# Altium schematic sheet Whitespace_Daughtercard_xceiver.SchDoc: RF Transceiver Top Level Design & Signals
size A2; Author: Ryan E. Guerra; Revision: 1.0; SheetNumber: 4; SheetTotal: 10
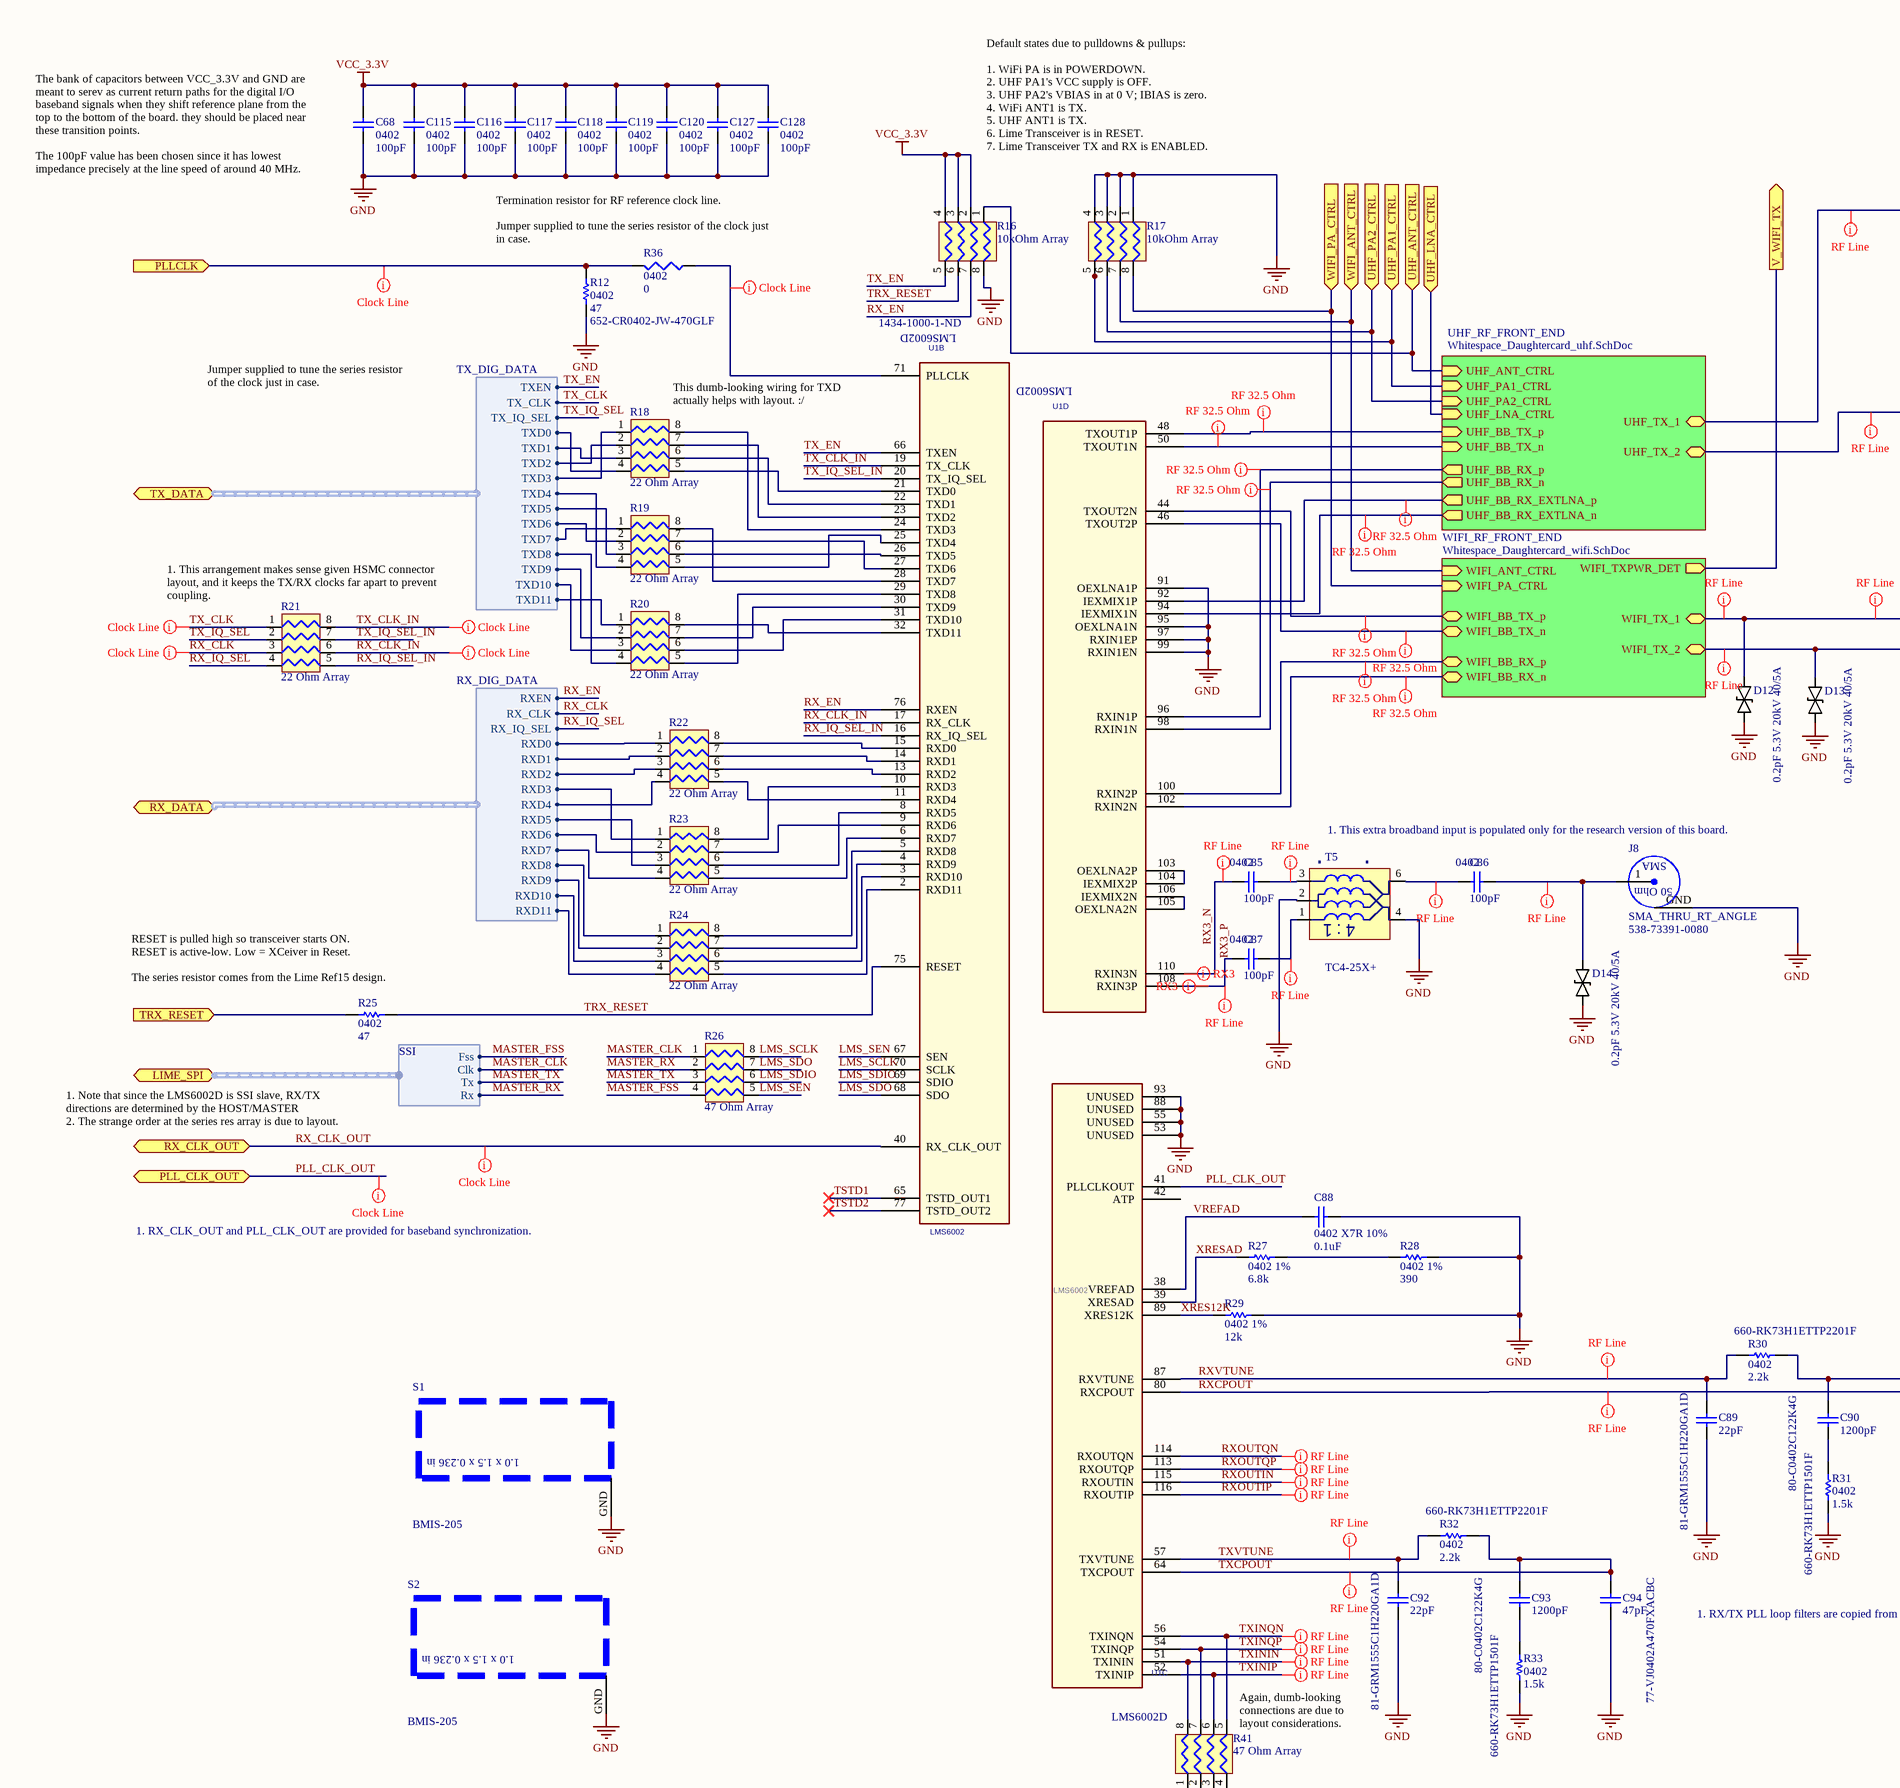
[diagram p0: Whitespace_Daughtercard_xceiver.SchDoc, top left]
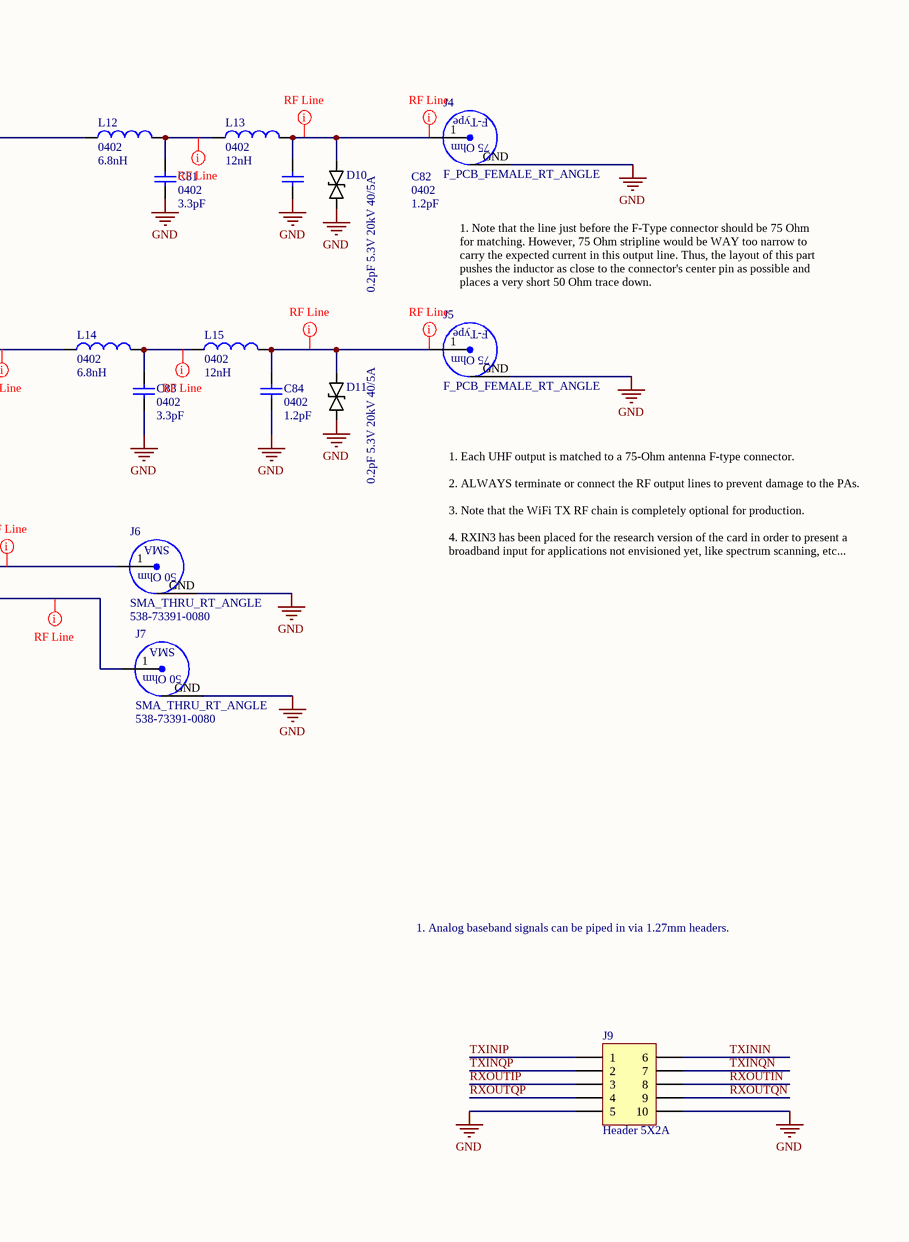
[diagram p1: Whitespace_Daughtercard_xceiver.SchDoc, top right]
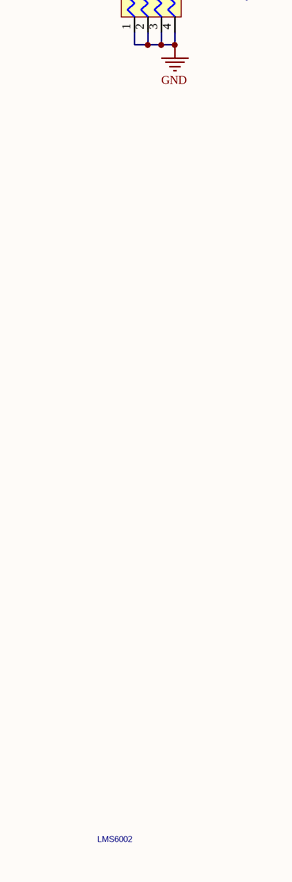
[diagram p2: Whitespace_Daughtercard_xceiver.SchDoc, bottom left]
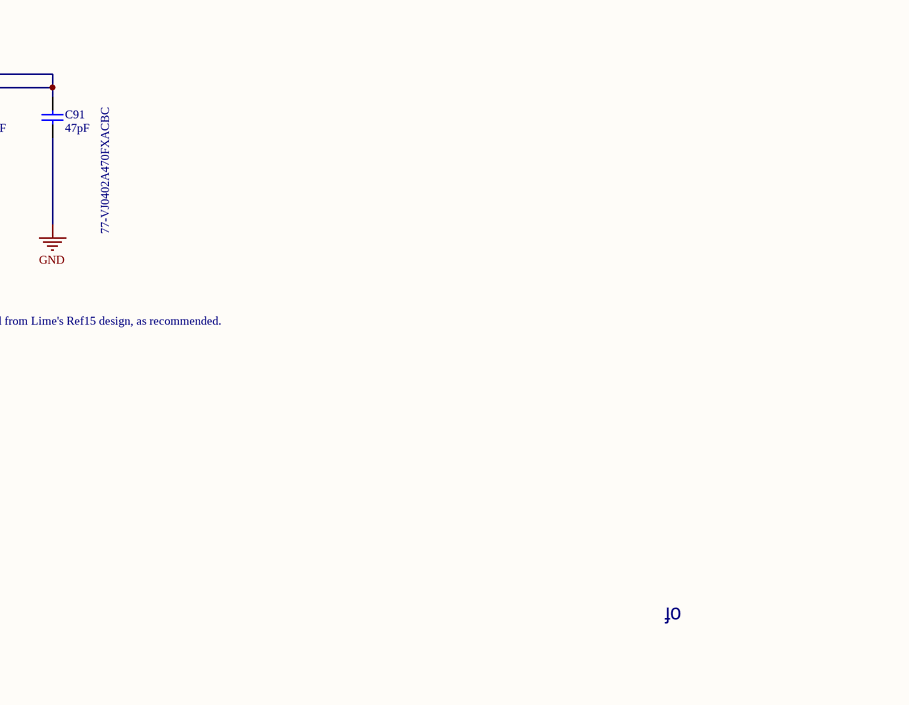
[diagram p3: Whitespace_Daughtercard_xceiver.SchDoc, bottom right]

## Parts
C68  0402  value 100pF  [0402_SMT_v3]
C81  0402  value 3.3pF  [0402_SMT_v3]
C82  0402  value 1.2pF  [0402_SMT_v3]
C83  0402  value 3.3pF  [0402_SMT_v3]
C84  0402  value 1.2pF  [0402_SMT_v3]
C85  0402  value 100pF  [0402_SMT_V3]
C86  0402  value 100pF  [0402_SMT_V3]
C87  0402  value 100pF  [0402_SMT_V3]
C88  0402 X7R 10%  value 0.1uF  [0402_SMT_V3]
C89  value 22pF  Supplier Part Number 1: 81-GRM1555C1H220GA1D  [0402_SMT_v3]  (hidden comment: 0402)
C90  value 1200pF  Supplier Part Number 1: 80-C0402C122K4G  [0402_SMT_v3]  (hidden comment: 0402)
C91  value 47pF  Supplier Part Number 1: 77-VJ0402A470FXACBC  [0402_SMT_v3]  (hidden comment: 0402)
C92  value 22pF  Supplier Part Number 1: 81-GRM1555C1H220GA1D  [0402_SMT_v3]  (hidden comment: 0402)
C93  value 1200pF  Supplier Part Number 1: 80-C0402C122K4G  [0402_SMT_v3]  (hidden comment: 0402)
C94  value 47pF  Supplier Part Number 1: 77-VJ0402A470FXACBC  [0402_SMT_v3]  (hidden comment: 0402)
C115  0402  value 100pF  [0402_SMT_v3]
C116  0402  value 100pF  [0402_SMT_v3]
C117  0402  value 100pF  [0402_SMT_v3]
C118  0402  value 100pF  [0402_SMT_v3]
C119  0402  value 100pF  [0402_SMT_v3]
C120  0402  value 100pF  [0402_SMT_v3]
C127  0402  value 100pF  [0402_SMT_v3]
C128  0402  value 100pF  [0402_SMT_v3]
D10  0.2pF 5.3V 20kV 40/5A  [TSLP-2-17]
D11  0.2pF 5.3V 20kV 40/5A  [TSLP-2-17]
D12  0.2pF 5.3V 20kV 40/5A  [TSLP-2-17]
D13  0.2pF 5.3V 20kV 40/5A  [TSLP-2-17]
D14  0.2pF 5.3V 20kV 40/5A  [TSLP-2-17]
J4  F_PCB_FEMALE_RT_ANGLE  [F_RT_ANGLE_PCB_FEMALE_5-1634540-1]
J5  F_PCB_FEMALE_RT_ANGLE  [F_RT_ANGLE_PCB_FEMALE_5-1634540-1]
J6  SMA_THRU_RT_ANGLE  Supplier Part Number 1: 538-73391-0080  [SMA_PCB_RtAngle_Female_MolexSD-73391-008_v4]
J7  SMA_THRU_RT_ANGLE  Supplier Part Number 1: 538-73391-0080  [SMA_PCB_RtAngle_Female_MolexSD-73391-008_v4]
J8  SMA_THRU_RT_ANGLE  Supplier Part Number 1: 538-73391-0080  [SMA_PCB_RtAngle_Female_MolexSD-73391-008_v4]
J9  Header 5X2A  [HDR2X5_CEN]
L12  0402  value 6.8nH  [0402_SMT_v3]
L13  0402  value 12nH  [0402_SMT_v3]
L14  0402  value 6.8nH  [0402_SMT_v3]
L15  0402  value 12nH  [0402_SMT_v3]
R12  0402  value 47  Supplier Part Number 1: 652-CR0402-JW-470GLF  [0402_SMT_v3]
R16  10kOhm Array  [741X083_ChipArray_0402x4_v2]
R17  10kOhm Array  [741X083_ChipArray_0402x4_v2]
R18  22 Ohm Array  [741X083_ChipArray_0402x4_v2]
R19  22 Ohm Array  [741X083_ChipArray_0402x4_v2]
R20  22 Ohm Array  [741X083_ChipArray_0402x4_v2]
R21  22 Ohm Array  [741X083_ChipArray_0402x4_v2]
R22  22 Ohm Array  [741X083_ChipArray_0402x4_v2]
R23  22 Ohm Array  [741X083_ChipArray_0402x4_v2]
R24  22 Ohm Array  [741X083_ChipArray_0402x4_v2]
R25  0402  value 47  [0402_SMT_v3]
R26  47 Ohm Array  [741X083_ChipArray_0402x4_v2]
R27  0402 1%  value 6.8k  [0402_SMT_v3]
R28  0402 1%  value 390  [0402_SMT_v3]
R29  0402 1%  value 12k  [0402_SMT_v3]
R30  0402  value 2.2k  Supplier Part Number 1: 660-RK73H1ETTP2201F  [0402_SMT_v3]
R31  0402  value 1.5k  Supplier Part Number 1: 660-RK73H1ETTP1501F  [0402_SMT_v3]
R32  0402  value 2.2k  Supplier Part Number 1: 660-RK73H1ETTP2201F  [0402_SMT_v3]
R33  0402  value 1.5k  Supplier Part Number 1: 660-RK73H1ETTP1501F  [0402_SMT_v3]
R36  0402  value 0  [0402_SMT_v3]
R41  47 Ohm Array  [741X083_ChipArray_0402x4_v2]
S1  BMIS-205  [BMIS-205]
S2  BMIS-205  [BMIS-205]
T5  TC4-25X+  [AT224-1_V2]
U1  LMS6002  Supplier Part Number 1: 1434-1000-1-ND  [LMS6002D_VIAOFFPAD_v2_Window]  (parts B,C,D of 4)

## Sub-sheets
UHF_RF_FRONT_END = Whitespace_Daughtercard_uhf.SchDoc: UHF_PA2_CTRL (in), UHF_TX_1 (bidir), UHF_TX_2 (bidir), UHF_ANT_CTRL (in), UHF_PA1_CTRL (in), UHF_BB_TX_p (in), UHF_BB_TX_n (in), UHF_BB_RX_p (out), UHF_BB_RX_n (out), UHF_BB_RX_EXTLNA_p (out), UHF_BB_RX_EXTLNA_n (out), UHF_LNA_CTRL (in)
WIFI_RF_FRONT_END = Whitespace_Daughtercard_wifi.SchDoc: WIFI_TXPWR_DET (out), WIFI_TX_2, WIFI_TX_1, WIFI_BB_TX_p, WIFI_BB_RX_p, WIFI_BB_RX_n, WIFI_BB_TX_n, WIFI_ANT_CTRL (in), WIFI_PA_CTRL (in)

## Ports
LIME_SPI (harness SSI), PLL_CLK_OUT, PLLCLK (in), RX_CLK_OUT, RX_DATA (harness RX_DIG_DATA), TRX_RESET (in), TX_DATA (harness TX_DIG_DATA), UHF_ANT_CTRL (in), UHF_LNA_CTRL (in), UHF_PA1_CTRL (in), UHF_PA2_CTRL (in), V_WIFI_TX (out), WIFI_ANT_CTRL (in), WIFI_PA_CTRL (in)

## Harnesses
TX_DIG_DATA: TXEN, TX_CLK, TX_IQ_SEL, TXD0, TXD1, TXD2, TXD3, TXD4, TXD5, TXD6, TXD7, TXD8, TXD9, TXD10, TXD11
RX_DIG_DATA: RXEN, RX_CLK, RX_IQ_SEL, RXD0, RXD2, RXD3, RXD4, RXD5, RXD6, RXD7, RXD8, RXD9, RXD10, RXD11, RXD1
SSI: Fss, Clk, Tx, Rx

## Nets
GND: C68.2 C81.1 C82.1 C83.1 C84.1 C88.1 C89.1 C91.1 C92.1 C94.1 C115.2 C116.2 C117.2 C118.2 C119.2 C120.2 C127.2 C128.2 D10.1 D11.1 D12.1 D13.1 D14.1 J4.GND J5.GND J6.GND J7.GND J8.GND J9.5 J9.10 R12.1 R16.8 R17.1 R17.2 R17.3 R17.4 R28.1 R29.2 R31.1 R33.1 R41.1 R41.2 R41.3 R41.4 S1.GND S2.GND T5.2(S_CT) T5.4(P) U1.53(UNUSED) U1.55(UNUSED) U1.88(UNUSED) U1.91(OEXLNA1P) U1.93(UNUSED) U1.95(OEXLNA1N) U1.97(RXIN1EP) U1.99(RXIN1EN)
VCC_3.3V: C68.1 C115.1 C116.1 C117.1 C118.1 C119.1 C120.1 C127.1 C128.1 R16.2 R16.3 R16.4
LMS_SCLK: R26.8 U1.70(SCLK)
LMS_SDIO: R26.6 U1.69(SDIO)
LMS_SDO: R26.7 U1.68(SDO)
LMS_SEN: R26.5 U1.67(SEN)
MASTER_CLK: R26.1 ; port LIME_SPI.Clk
MASTER_FSS: R26.4 ; port LIME_SPI.Fss
MASTER_RX: R26.2 ; port LIME_SPI.Rx
MASTER_TX: R26.3 ; port LIME_SPI.Tx
PLL_CLK_OUT: U1.41(PLLCLKOUT) ; port PLL_CLK_OUT
PLLCLK: R12.2 R36.2 ; port PLLCLK
RX3_N: C85.2 U1.110(RXIN3N)
RX3_P: C87.2 U1.108(RXIN3P)
RX_CLK: R21.3 ; port RX_DATA.RX_CLK
RX_CLK_IN: R21.6 U1.17(RX_CLK)
RX_CLK_OUT: U1.40(RX_CLK_OUT) ; port RX_CLK_OUT
RX_EN: R16.7 U1.76(RXEN) ; port RX_DATA.RXEN
RX_IQ_SEL: R21.4 ; port RX_DATA.RX_IQ_SEL
RX_IQ_SEL_IN: R21.5 U1.16(RX_IQ_SEL)
RXCPOUT: C90.2 C91.2 R30.2 U1.80(RXCPOUT)
RXOUTIN: J9.8 U1.115(RXOUTIN)
RXOUTIP: J9.3 U1.116(RXOUTIP)
RXOUTQN: J9.9 U1.114(RXOUTQN)
RXOUTQP: J9.4 U1.113(RXOUTQP)
RXVTUNE: C89.2 R30.1 U1.87(RXVTUNE)
TRX_RESET: R16.6 R25.1 U1.75(RESET)
TRX_RESET: R25.2 ; port TRX_RESET  [a separate net that carries the same name]
TSTD1: U1.65(TSTD_OUT1)
TSTD2: U1.77(TSTD_OUT2)
TX_CLK: R21.1 ; port TX_DATA.TX_CLK
TX_CLK_IN: R21.8 U1.19(TX_CLK)
TX_EN: R16.5 U1.66(TXEN) ; port TX_DATA.TXEN
TX_IQ_SEL: R21.2 ; port TX_DATA.TX_IQ_SEL
TX_IQ_SEL_IN: R21.7 U1.20(TX_IQ_SEL)
TXCPOUT: C93.2 C94.2 R32.2 U1.64(TXCPOUT)
TXININ: J9.6 R41.8 U1.51(TXININ)
TXINIP: J9.1 R41.6 U1.52(TXINIP)
TXINQN: J9.7 R41.5 U1.56(TXINQN)
TXINQP: J9.2 R41.7 U1.54(TXINQP)
TXVTUNE: C92.2 R32.1 U1.57(TXVTUNE)
UHF_ANT_CTRL: R16.1 ; port UHF_ANT_CTRL, sheet UHF_RF_FRONT_END/UHF_ANT_CTRL
UHF_LNA_CTRL: port UHF_LNA_CTRL, sheet UHF_RF_FRONT_END/UHF_LNA_CTRL
UHF_PA1_CTRL: R17.5 ; port UHF_PA1_CTRL, sheet UHF_RF_FRONT_END/UHF_PA1_CTRL
UHF_PA2_CTRL: R17.6 ; port UHF_PA2_CTRL, sheet UHF_RF_FRONT_END/UHF_PA2_CTRL
V_WIFI_TX: port V_WIFI_TX, sheet WIFI_RF_FRONT_END/WIFI_TXPWR_DET
VREFAD: C88.2 U1.38(VREFAD)
WIFI_ANT_CTRL: R17.7 ; port WIFI_ANT_CTRL, sheet WIFI_RF_FRONT_END/WIFI_ANT_CTRL
WIFI_PA_CTRL: R17.8 ; port WIFI_PA_CTRL, sheet WIFI_RF_FRONT_END/WIFI_PA_CTRL
XRES12K: R29.1 U1.89(XRES12K)
XRESAD: R27.2 U1.39(XRESAD)
NetC81_2: C81.2 L12.2 L13.1
NetC82_2: C82.2 D10.2 J4.1(Signal) L13.2
NetC83_2: C83.2 L14.2 L15.1
NetC84_2: C84.2 D11.2 J5.1(Signal) L15.2
NetC85_1: C85.1 T5.3(S_DOT)
NetC86_1: C86.1 D14.2 J8.1(Signal)
NetC86_2: C86.2 T5.6(P_DOT)
NetC87_1: C87.1 T5.1(S)
NetC90_1: C90.1 R31.2
NetC93_1: C93.1 R33.2
NetD12_2: D12.2 J6.1(Signal) ; sheet WIFI_RF_FRONT_END/WIFI_TX_1
NetD13_2: D13.2 J7.1(Signal) ; sheet WIFI_RF_FRONT_END/WIFI_TX_2
NetL12_1: L12.1 ; sheet UHF_RF_FRONT_END/UHF_TX_1
NetL14_1: L14.1 ; sheet UHF_RF_FRONT_END/UHF_TX_2
NetR18_1: R18.1 ; port TX_DATA.TXD3
NetR18_2: R18.2 ; port TX_DATA.TXD2
NetR18_3: R18.3 ; port TX_DATA.TXD1
NetR18_4: R18.4 ; port TX_DATA.TXD0
NetR18_5: R18.5 U1.21(TXD0)
NetR18_6: R18.6 U1.22(TXD1)
NetR18_7: R18.7 U1.23(TXD2)
NetR18_8: R18.8 U1.24(TXD3)
NetR19_1: R19.1 ; port TX_DATA.TXD7
NetR19_2: R19.2 ; port TX_DATA.TXD6
NetR19_3: R19.3 ; port TX_DATA.TXD5
NetR19_4: R19.4 ; port TX_DATA.TXD4
NetR19_5: R19.5 U1.25(TXD4)
NetR19_6: R19.6 U1.26(TXD5)
NetR19_7: R19.7 U1.27(TXD6)
NetR19_8: R19.8 U1.28(TXD7)
NetR20_1: R20.1 ; port TX_DATA.TXD11
NetR20_2: R20.2 ; port TX_DATA.TXD9
NetR20_3: R20.3 ; port TX_DATA.TXD10
NetR20_4: R20.4 ; port TX_DATA.TXD8
NetR20_5: R20.5 U1.29(TXD8)
NetR20_6: R20.6 U1.31(TXD10)
NetR20_7: R20.7 U1.30(TXD9)
NetR20_8: R20.8 U1.32(TXD11)
NetR22_1: R22.1 ; port RX_DATA.RXD0
NetR22_2: R22.2 ; port RX_DATA.RXD1
NetR22_3: R22.3 ; port RX_DATA.RXD2
NetR22_4: R22.4 ; port RX_DATA.RXD4
NetR22_5: R22.5 U1.11(RXD4)
NetR22_6: R22.6 U1.13(RXD2)
NetR22_7: R22.7 U1.14(RXD1)
NetR22_8: R22.8 U1.15(RXD0)
NetR23_1: R23.1 ; port RX_DATA.RXD3
NetR23_2: R23.2 ; port RX_DATA.RXD6
NetR23_3: R23.3 ; port RX_DATA.RXD5
NetR23_4: R23.4 ; port RX_DATA.RXD7
NetR23_5: R23.5 U1.6(RXD7)
NetR23_6: R23.6 U1.8(RXD5)
NetR23_7: R23.7 U1.9(RXD6)
NetR23_8: R23.8 U1.10(RXD3)
NetR24_1: R24.1 ; port RX_DATA.RXD8
NetR24_2: R24.2 ; port RX_DATA.RXD9
NetR24_3: R24.3 ; port RX_DATA.RXD10
NetR24_4: R24.4 ; port RX_DATA.RXD11
NetR24_5: R24.5 U1.2(RXD11)
NetR24_6: R24.6 U1.3(RXD10)
NetR24_7: R24.7 U1.4(RXD9)
NetR24_8: R24.8 U1.5(RXD8)
NetR27_1: R27.1 R28.2
NetR36_1: R36.1 U1.71(PLLCLK)
NetU1_44: U1.44(TXOUT2N) ; sheet WIFI_RF_FRONT_END/WIFI_BB_TX_p
NetU1_46: U1.46(TXOUT2P) ; sheet WIFI_RF_FRONT_END/WIFI_BB_TX_n
NetU1_48: U1.48(TXOUT1P) ; sheet UHF_RF_FRONT_END/UHF_BB_TX_p
NetU1_50: U1.50(TXOUT1N) ; sheet UHF_RF_FRONT_END/UHF_BB_TX_n
NetU1_92: U1.92(IEXMIX1P) ; sheet UHF_RF_FRONT_END/UHF_BB_RX_EXTLNA_p
NetU1_94: U1.94(IEXMIX1N) ; sheet UHF_RF_FRONT_END/UHF_BB_RX_EXTLNA_n
NetU1_96: U1.96(RXIN1P) ; sheet UHF_RF_FRONT_END/UHF_BB_RX_p
NetU1_98: U1.98(RXIN1N) ; sheet UHF_RF_FRONT_END/UHF_BB_RX_n
NetU1_100: U1.100(RXIN2P) ; sheet WIFI_RF_FRONT_END/WIFI_BB_RX_p
NetU1_102: U1.102(RXIN2N) ; sheet WIFI_RF_FRONT_END/WIFI_BB_RX_n
NetU1_103: U1.103(OEXLNA2P) U1.104(IEXMIX2P)
NetU1_105: U1.105(OEXLNA2N) U1.106(IEXMIX2N)

Not connected (* = marked no-connect by the designer): U1 42(ATP)

## Layout directives
rule Impedance Constraint [Min = 49.00    Max = 51.00    ]; net class RF: NetC81_2, NetC82_2, NetC83_2, NetC84_2, NetC85_1, NetC86_1, NetC86_2, NetC87_1, NetD12_2, NetD13_2, NetL12_1, NetL14_1, RX3_N, RX3_P, RXCPOUT, RXOUTIN, RXOUTIP, RXOUTQN, RXOUTQP, RXVTUNE, TXCPOUT, TXININ, TXINIP, TXINQN, TXINQP, TXVTUNE
rule Impedance Constraint [Min = 32.00    Max = 33.00    ]; net class RF_325: NetU1_44, NetU1_46, NetU1_48, NetU1_50, NetU1_92, NetU1_94, NetU1_96, NetU1_98, NetU1_100, NetU1_102
rule Impedance Constraint [Min = 49.00    Max = 51.00    ]; net class CLK: NetR36_1, PLL_CLK_OUT, PLLCLK, RX_CLK, RX_CLK_IN, RX_CLK_OUT, TX_CLK, TX_CLK_IN
differential pair: RX3_N, RX3_P

## Notes on the sheet
- (near C68) The bank of capacitors between VCC_3.3V and GND are meant to serev as current return paths for the digital I/O baseband signals when they shift reference plane from the top to the bottom of the board. they should be placed near these transition points.
  The 100pF value has been chosen since it has lowest impedance precisely at the line speed of around 40 MHz.
- Default states due to pulldowns & pullups:
  1. WiFi PA is in POWERDOWN.
  2. UHF PA1's VCC supply is OFF.
  3. UHF PA2's VBIAS in at 0 V; IBIAS is zero.
  4. WiFi ANT1 is TX.
  5. UHF ANT1 is TX.
  6. Lime Transceiver is in RESET.
  7. Lime Transceiver TX and RX is ENABLED.
- Termination resistor for RF reference clock line.
  Jumper supplied to tune the series resistor of the clock just in case.
- 1. Note that the line just before the F-Type connector should be 75 Ohm for matching. However, 75 Ohm stripline would be WAY too narrow to carry the expected current in this output line. Thus, the layout of this part pushes the inductor as close to the connector's center pin as possible and places a very short 50 Ohm trace down.
- Jumper supplied to tune the series resistor of the clock just in case.
- (near R18) This dumb-looking wiring for TXD actually helps with layout. :/
- (near R21) 1. This arrangement makes sense given HSMC connector layout, and it keeps the TX/RX clocks far apart to prevent coupling.
- 1. Each UHF output is matched to a 75-Ohm antenna F-type connector.
  2. ALWAYS terminate or connect the RF output lines to prevent damage to the PAs.
  3. Note that the WiFi TX RF chain is completely optional for production.
  4. RXIN3 has been placed for the research version of the card in order to present a broadband input for applications not envisioned yet, like spectrum scanning, etc...
- 1. This extra broadband input is populated only for the research version of this board.
- 1. Analog baseband signals can be piped in via 1.27mm headers.
- (near R25) RESET is pulled high so transceiver starts ON.
  RESET is active-low. Low = XCeiver in Reset.
  The series resistor comes from the Lime Ref15 design.
- 1. Note that since the LMS6002D is SSI slave, RX/TX directions are determined by the HOST/MASTER
  2. The strange order at the series res array is due to layout.
- 1. RX_CLK_OUT and PLL_CLK_OUT are provided for baseband synchronization.
- 1. RX/TX PLL loop filters are copied from Lime's Ref15 design, as recommended.
- (near R41) Again, dumb-looking connections are due to layout considerations.
- of
- (in symbol BMIS-205) 1.0 x 1.5 x 0.236 in
- (in symbol F_PCB_FEMALE_RT_ANGLE) F-Type; 75 Ohm
- (in symbol LMS6002, part B) LMS6002D
- (in symbol LMS6002, part C) LMS6002D
- (in symbol LMS6002, part D) LMS6002D
- (in symbol SMA_PCB_RT_ANGLE) SMA; 50 Ohm
- (in symbol TC4-25X+) .; 4 : 1

## Library data of the parts
C68 C81-C84 C115-C120 C127 C128 = Cap Semi: Capacitor (Semiconductor SIM Model); Published: 8-Jun-2000; LatestRevisionDate: 29-May-2009; LatestRevisionNote: IPC-7351 Footprint Added.; PackageReference: C1206; Publisher: Altium Limited; PackageDescription: Chip Capacitor; Supplier 1: Mouser
  C68 C115-C120 C127 C128: Supplier Part Number 1: 81-GRM1555C1H101GA1D
  C81 C83: Supplier Part Number 1: 81-GRM1555C1H3R3WA1D
  C82 C84: Supplier Part Number 1: 81-GRM1555C1H1R2WA1D
C85-C88 = Cap: Capacitor; Published: 8-Jun-2000; LatestRevisionDate: 17-Jul-2002; LatestRevisionNote: Re-released for DXP Platform.; PackageReference: RAD-0.3; Publisher: Altium Limited; PackageDescription: Radial Cap, Thru-Hole; 2 Leads; 0.3 in Pin Spacing; Supplier 1: Mouser
  C85-C87: Supplier Part Number 1: 81-GRM1555C1H101GA1D
  C88: Supplier Part Number 1: 810-C1005X7R1H104K
C89-C94 = Cap_0402: 0402 SMT Cap; Supplier 1: Mouser
D10-D14 = ESD0P2RF-02LRH: Bidirectional TVS Diode for RF Protection - Infineon; Supplier 1: Mouser; Supplier Part Number 1: 726-ESD0P2RF02LRH726
J4 J5 = F_PCB_FEMALE_RT_ANGLE: Right-Angle Through-PCB Female F-Type Connector, TE Connectivity, 75 Ohm; Supplier 1: Mouser; Supplier Part Number 1: 571-5-1634540-1
J6-J8 = SMA_PCB_RT_ANGLE: SMA 50 Ohm Female-NP Through Mount, Right-Angle Connector; Supplier 1: Mouser
J9 = Header 5X2A: Header, 5-Pin, Dual row; LatestRevisionDate: 17-Jul-2002; LatestRevisionNote: Re-released for DXP Platform.; Publisher: Altium Limited
L12-L15 = Inductor: Code_IEC: 1005; Published: 8-Jun-2000; LatestRevisionDate: 29-May-2009; LatestRevisionNote: IPC-7351 Footprint Added.; PackageReference: 0402-A; Publisher: Altium Limited; PackageDescription: Chip Inductor; Code_JEITA: 0402; Supplier 1: Mouser
  L12 L14: Supplier Part Number 1: 81-LQP15MN6N8B02D
  L13 L15: Supplier Part Number 1: 81-LQP15MN12NG02D
R12 R25 R27-R29 = Res Semi: Semiconductor Resistor; Published: 8-Jun-2000; LatestRevisionDate: 17-Jul-2002; LatestRevisionNote: Re-released for DXP Platform.; PackageReference: AXIAL-0.5; Publisher: Altium Limited; PackageDescription: Axial Device, Thru-Hole; 2 Leads; 0.5 in Pin Spacing; Supplier 1: Mouser
  R25: Supplier Part Number 1: 667-ERJ-2GEJ470X
  R27: Supplier Part Number 1: 667-ERJ-2RKF6801X
  R28: Supplier Part Number 1: 667-ERJ-2RKF3900X
  R29: Supplier Part Number 1: 667-ERJ-2RKF1202X
R16 R17 = 741X083103JP: 10kOhm Ohm 4x0402 Resistor Array; Supplier 1: Mouser; Supplier Part Number 1: 774-741X083103JP
R18-R24 = 741X083220JP: 22 Ohm 4x0402 Resistor Array; Supplier 1: Mouser; Supplier Part Number 1: 774-741X083220JP
R26 R41 = 741X083470JP: 47 Ohm 4x0402 Resistor Array; Supplier 1: Mouser; Supplier Part Number 1: 774-741X083470JP
R30-R33 = Res_0402: 0402 SMT Resistor; Supplier 1: Mouser
R36 = Res3: Resistor; Published: 8-Jun-2000; LatestRevisionDate: 29-May-2009; LatestRevisionNote: IPC-7351 Footprint Added.; PackageReference: J1-0603; Publisher: Altium Limited; PackageDescription: Chip Resistor; Supplier 1: Mouser; Supplier Part Number 1: 660-RK73Z1ETTP
S1 S2 = BMIS-205: EMI Shield 1.0 x 1.5 x 0.236 LairdTech; Supplier 1: Mouser; Supplier Part Number 1: 739-BMIS-205-F
T5 = TC4-25X+: Mini-Circuits Type A Transformer, 4:1 Ohm, CT, 500-2500MHz
U1 = LMS6002: Lime Microsystems Wideband Transceiver Module; Supplier 1: Digi-Key